# EAGLE schematic main (EAGLE 9.0.1)
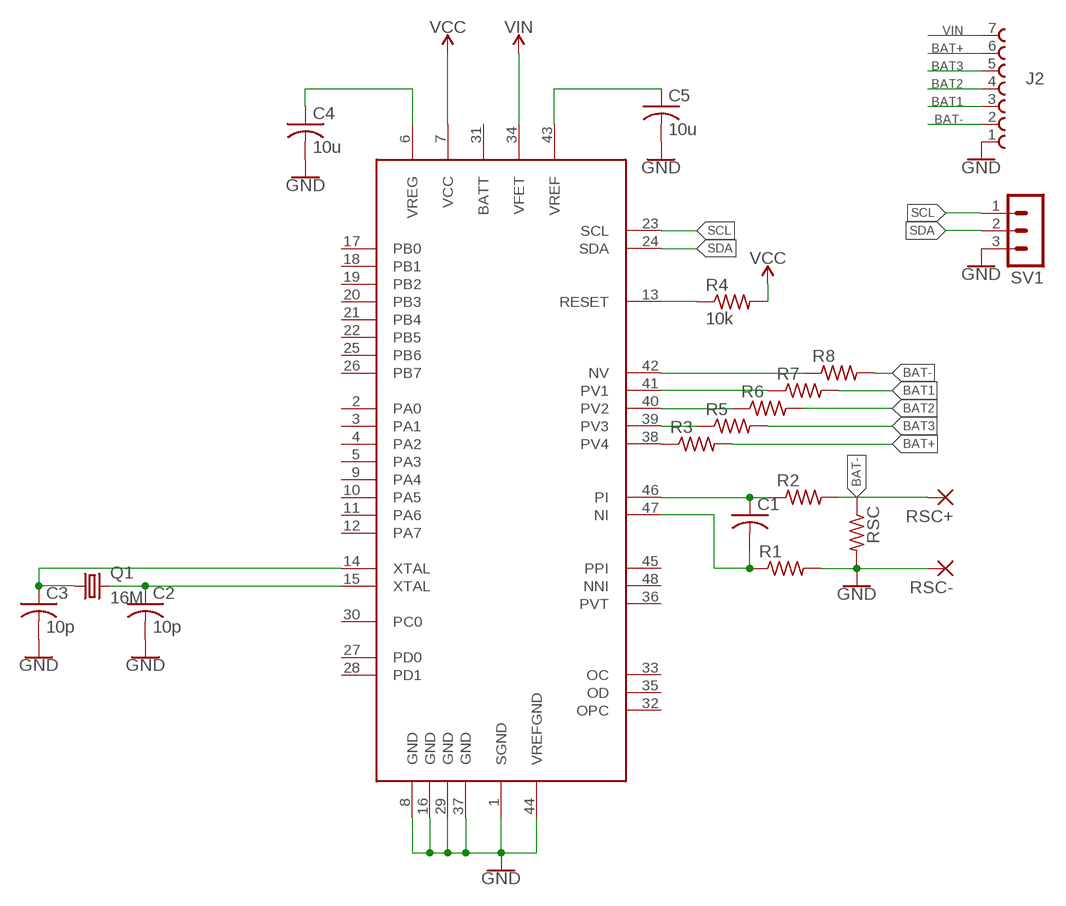
[diagram p0: schematic, sheet 1]

## Parts
C1  C-USC0805  [C0805]
C2  10p  C-USC0805  [C0805]
C3  10p  C-USC0805  [C0805]
C4  10u  C-USC0805  [C0805]
C5  10u  C-USC0805  [C0805]
J2  691136710007  [691136710007]
Q1  16M  CRYSTALHC49U-V  [HC49U-V]
R1  R-US_R0805  [R0805]
R2  R-US_R0805  [R0805]
R3  R-US_R0805  [R0805]
R4  10k  R-US_R0603  [R0603]
R5  R-US_R0805  [R0805]
R6  R-US_R0805  [R0805]
R7  R-US_R0805  [R0805]
R8  R-US_R0805  [R0805]
RSC  R-US_R0805  [R0805]
RSC+  2,54/1,0  [2,54/1,0]
RSC-  2,54/1,0  [2,54/1,0]
SV1  MA03-1  [MA03-1]
U$1  ATMEGA406  [LQFP48]

## Nets
BAT1: J2.3 R7.2
BAT2: J2.4 R6.2
BAT3: J2.5 R5.2
BAT+: J2.6 R3.2
BAT-: J2.2 R2.2 R8.2 RSC+.1(P) RSC.1
GND: C2.2 C3.2 C4.2 C5.2 J2.1 R1.2 RSC-.1(P) RSC.2 SV1.3 U$1.1(SGND) U$1.8(GND) U$1.16(GND) U$1.29(GND) U$1.37(GND) U$1.44(VREFGND)
N$1: C4.1 U$1.6(VREG)
N$2: C1.1 R2.1 U$1.46(PI)
N$3: R3.1 U$1.38(PV4)
N$4: R5.1 U$1.39(PV3)
N$5: C1.2 R1.1 U$1.47(NI)
N$6: C2.1 Q1.2 U$1.15(XTAL)
N$7: C3.1 Q1.1 U$1.14(XTAL)
N$8: R4.1 U$1.13(RESET)
N$9: C5.1 U$1.43(VREF)
N$10: R6.1 U$1.40(PV2)
N$11: R7.1 U$1.41(PV1)
N$12: R8.1 U$1.42(NV)
SCL: SV1.1 U$1.23(SCL)
SDA: SV1.2 U$1.24(SDA)
VCC: R4.2 U$1.7(VCC)
VIN: J2.7 U$1.34(VFET)
Unconnected: U$1.2(PA0) U$1.3(PA1) U$1.4(PA2) U$1.5(PA3) U$1.9(PA4) U$1.10(PA5) U$1.11(PA6) U$1.12(PA7) U$1.17(PB0) U$1.18(PB1) U$1.19(PB2) U$1.20(PB3) U$1.21(PB4) U$1.22(PB5) U$1.25(PB6) U$1.26(PB7) U$1.27(PD0) U$1.28(PD1) U$1.30(PC0) U$1.31(BATT) U$1.32(OPC) U$1.33(OC) U$1.35(OD) U$1.36(PVT) U$1.45(PPI) U$1.48(NNI)

## Library data of the parts
C1-C5 = rcl:C-US: CAPACITOR, American symbol; SPICEPREFIX: C
J2 = Wurth_Elektronik_Electromechanic_Terminal_Blocks_Connectors_rev17a:691136710007: SERIE 1367 - 5.00 MM - HORIZONTAL CABLE ENTRY WITH PRESSURE CLAMP - GLOW WIRE PLASTIC - WR-TBL =>ConTBL1 691136710007 Characteristics INSULATOR:PC FLAMABILITY RATING: UL94V0 COLOR: GREY METAL HOUSING: COPPER ALLOY / Ni+Sn TERMINAL SCREW: STEEL / Zn WIRE GUARD: COPPER ALLOY / Sn OPERATING TEMPERATURE:-30°C UP TO +120°C COMPLIANCE: LEAD FREE AND ROHS ELECTRICAL UL VDE CURRENT RATING: 16A 24A WORKING VOLTAGE: 300VAC 450VAC WITHSTANDING VOLTAGE: 1,6KV 2,5KV CONTACT RESISTANCE: 20 mOhm max <http://katalog.we-online.de/media/images/v2/Family_WR-TBL_5_00_1367_HORIZONTAL_ENTRY_W_PRESSURE_CLAMP_6911367100XX.jpg> Details see: http://katalog.we-online.de/en/em/TBL_5_00_1367_HORIZONTAL_ENTRY_W_PRESSURE_CLAMP_6911367100XX 2015 (C) Wurth Elektronik
Q1 = crystal:CRYSTAL: CRYSTAL; OC_FARNELL: 1666969; OC_NEWARK: unknown
R1-R8 RSC = rcl:R-US_: RESISTOR, American symbol; SPICEPREFIX: R
RSC+ RSC- = 7_segment_lib:2,54/1,0: THROUGH-HOLE PAD
SV1 = con-lstb:MA03-1: PIN HEADER; OC_FARNELL: unknown; OC_NEWARK: unknown
U$1 = 7_segment_lib:ATMEGA406